# EAGLE schematic electrodragon (EAGLE 7.5.0)
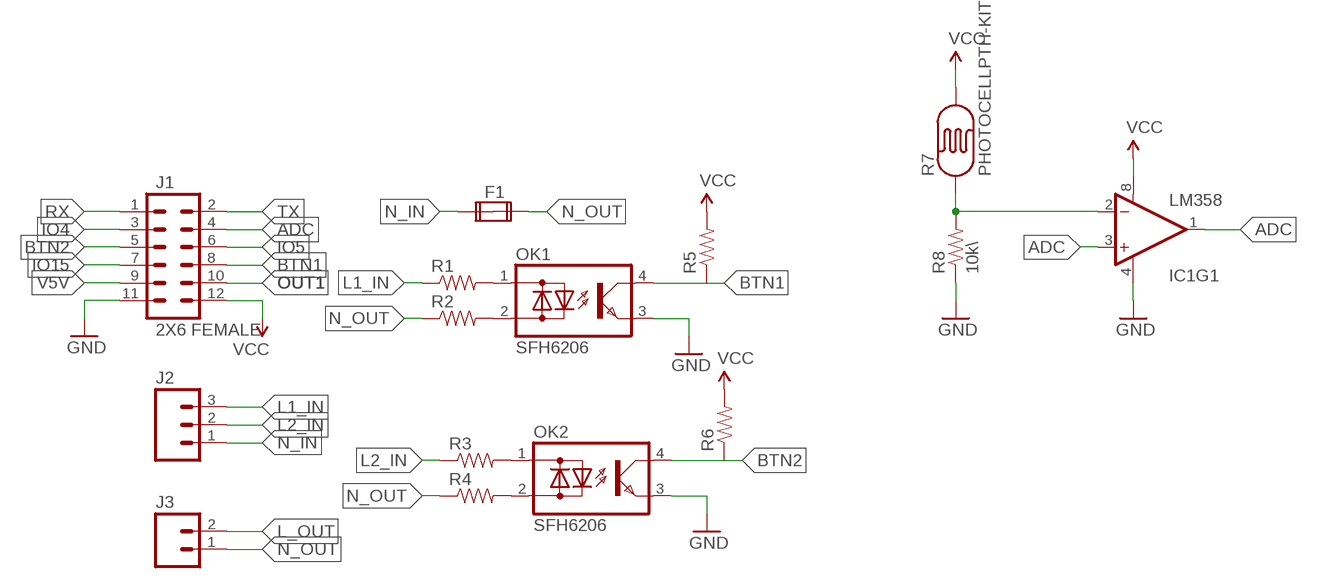
[diagram p0: schematic, sheet 1]

## Parts
F1  FUSE2P  [FUSE1]
IC1  LM358  [DIP08]
J1  2X6 FEMALE  M06X2PTH_FEMALE  [2X6]
J2  M03-SCREW-5MM  [SCREWTERMINAL-5MM-3]
J3  M025MM  [SCREWTERMINAL-5MM-2]
OK1  SFH6206  [DIL4-SMD]
OK2  SFH6206  [DIL4-SMD]
R1  RESISTORPTH-1/2W  [AXIAL-0.5]
R2  RESISTORPTH-1/2W  [AXIAL-0.5]
R3  RESISTORPTH-1/2W  [AXIAL-0.5]
R4  RESISTORPTH-1/2W  [AXIAL-0.5]
R5  RESISTOR0805-RES  [0805]
R6  RESISTOR0805-RES  [0805]
R7  PHOTOCELLPTH-KIT  [PHOTOCELL-KIT]
R8  10k\  RESISTOR0805-RES  [0805]

## Nets
ADC: IC1.1(OUT) IC1.3(+IN) J1.4
BTN1: J1.8 OK1.4(C)
BTN2: J1.5 OK2.4(C)
GND: IC1.4(V-) J1.11 OK1.3(E) OK2.3(E) R8.1
IO4: J1.3
IO5: J1.6
IO15: J1.7
L1_IN: J2.3 R1.P$1
L2_IN: J2.2 R3.P$1
L_OUT: J3.2
N$1: IC1.2(-IN) R7.1 R8.2
N$13: OK1.1(AC1) R1.P$2
N$14: OK1.2(AC2) R2.P$2
N$15: OK2.1(AC1) R3.P$2
N$16: OK2.2(AC2) R4.P$2
N_IN: F1.1A J2.1
N_OUT: F1.2A J3.1 R2.P$1 R4.P$1
OUT1: J1.10
RX: J1.1
TX: J1.2
V5V: J1.9
VCC: IC1.8(V+) J1.12 R5.2 R6.2 R7.2
Unconnected: F1.1B F1.2B IC1.5(+IN) IC1.6(-IN) IC1.7(OUT) R5.1 R6.1

## Library data of the parts
F1 = special:FUSE2P: FUSE 5 x 20 mm
IC1 = SparkFun-AnalogIC:LM358: Jellybean op-amp; PROD_ID: IC-09172
J1 = SparkFun-Connectors:M06X2; PROD_ID: CONN-12423
J2 = SparkFun-Connectors:M03: Header 3 Standard 3-pin 0.1" header. Use with straight break away headers (SKU : PRT-00116), right angle break away headers (PRT-00553), swiss pins (PRT-00743), machine pins (PRT-00117), and female headers (PRT-00115). Molex polarized connector foot print use with SKU : PRT-08232 with associated crimp pins and housings.; STOREFRONT_ID: PRT-08433
J3 = SparkFun-Connectors:M02: Standard 2-pin 0.1" header. Use with - straight break away headers ( PRT-00116) - right angle break away headers (PRT-00553) - swiss pins (PRT-00743) - machine pins (PRT-00117) - female headers (PRT-00115) Molex polarized connector foot print use with: PRT-08233 with associated crimp pins and housings. 2.54_SCREWTERM for use with PRT-10571. 3.5mm Screw Terminal footprints for PRT-08084 5mm Screw Terminal footprints for use with PRT-08432; STOREFRONT_ID: PRT-08432
OK1 OK2 = optodevices:SFH620: Optocoupler, Phototransistor Output, AC Input Source: http://www.vishay.com/docs/83675/sfh620.pdf
R1-R6 R8 = SparkFun-Passives:RESISTOR: Resistor Basic schematic elements and footprints for 0603, 1206, and PTH resistors.
R7 = SparkFun-Sensors:PHOTOCELL: CdS photoresistor. This is a low cost way to detect light levels. Resistance decreases with more incoming light. SparkFun SKU: SEN-09088